# Altium schematic sheet power.SchDoc
size A4
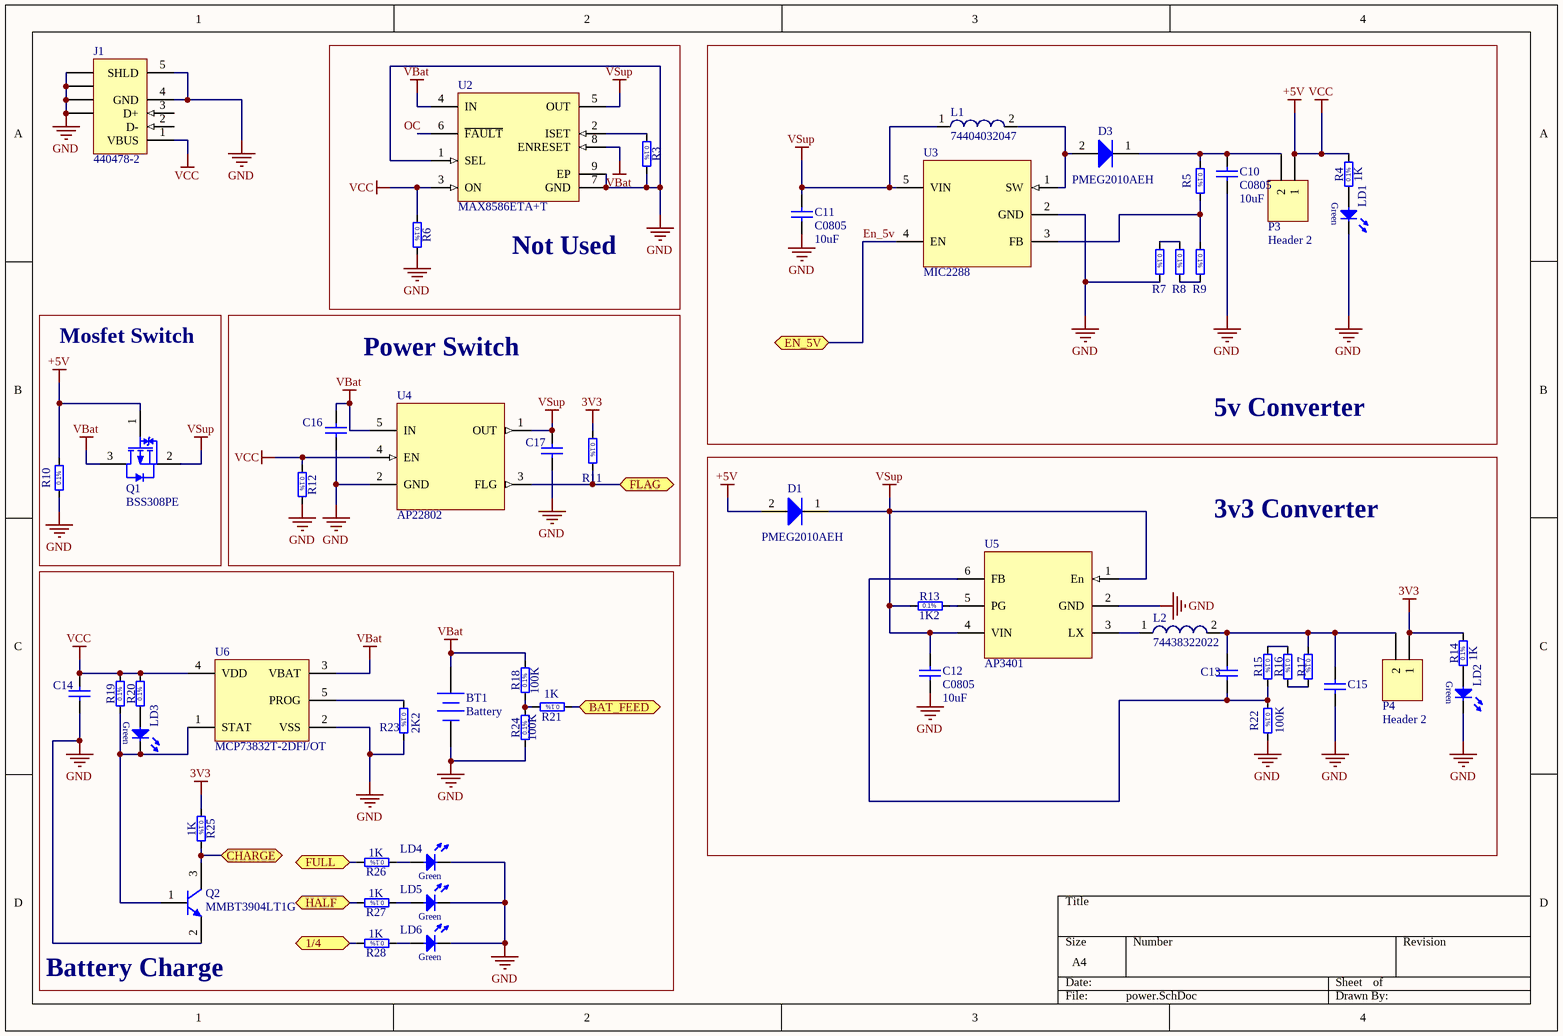
[diagram p0: power.SchDoc]

## Parts
BT1  Battery  [BAT-2]
C10  C0805  value 10uF  [0805]
C11  C0805  value 10uF  [0805]
C12  C0805  value 10uF  [0805]
C13  C0805  [0805]  (value not drawn)
C14  C0805  [0805]  (value not drawn)
C15  C0805  [0805]  (value not drawn)
C16  C0805  [0805]  (value not drawn)
C17  C0805  [0805]  (value not drawn)
D1  PMEG2010AEH  [ONSC-SOD-123-2-425-04_V]
D3  PMEG2010AEH  [ONSC-SOD-123-2-425-04_V]
J1  440478-2  [440478]
L1  74404032047  [WE-LQS 3015]
L2  74438322022  [SMD 2508]
LD1  Green  [LED_OSRAM_LGR971]  (value not drawn)
LD2  Green  [LED_OSRAM_LGR971]  (value not drawn)
LD3  Green  [LED_OSRAM_LGR971]  (value not drawn)
LD4  Green  [LED_OSRAM_LGR971]  (value not drawn)
LD5  Green  [LED_OSRAM_LGR971]  (value not drawn)
LD6  Green  [LED_OSRAM_LGR971]  (value not drawn)
P3  Header 2  [HDR1X2]
P4  Header 2  [HDR1X2]
Q1  BSS308PE  [INF-PG-SOT23_N]
Q2  MMBT3904LT1G  [ONSC-SOT-23-3-318-08_V]
R3  26K  [RESC2012X60N]  (value not drawn)
R4  1K  [RESC2012X60N]
R5  100K  [RESC2012X60N]  (value not drawn)
R6  1K2  [RESC2012X60N]  (value not drawn)
R7  10K  [RESC2012X60N]  (value not drawn)
R8  1K  [RESC2012X60N]  (value not drawn)
R9  100R  [RESC2012X60N]  (value not drawn)
R10  1K2  [RESC2012X60N]  (value not drawn)
R11  10K  [RESC2012X60N]  (value not drawn)
R12  1K2  [RESC2012X60N]  (value not drawn)
R13  1K2  [RESC2012X60N]
R14  1K  [RESC2012X60N]
R15  RC0805FR-07430KL  [RESC2012X60N]  (value not drawn)
R16  150K  [RESC2012X60N]  (value not drawn)
R17  150K  [RESC2012X60N]  (value not drawn)
R18  100K  [RESC2012X60N]
R19  1K  [RESC2012X60N]  (value not drawn)
R20  1K  [RESC2012X60N]  (value not drawn)
R21  1K  [RESC2012X60N]
R22  100K  [RESC2012X60N]
R23  2K2  [RESC2012X60N]
R24  100K  [RESC2012X60N]
R25  1K  [RESC2012X60N]
R26  1K  [RESC2012X60N]
R27  1K  [RESC2012X60N]
R28  1K  [RESC2012X60N]
U2  MAX8586ETA+T  [T833+2]
U3  MIC2288  [TSOT25]
U4  AP22802  [TSOT25]
U5  AP3401  [TSOT26]
U6  MCP73832T-2DFI/OT  [SOT-23-OT5_N]

## Blocks framed on the sheet
Not Used: R3 R6 U2
5v Converter: C10 C11 D3 L1 LD1 P3 R4 R5 R7-R9 U3
Mosfet Switch: Q1 R10
Power Switch: C16 C17 R11 R12 U4
3v3 Converter: C12 C13 C15 D1 L2 LD2 P4 R13-R17 R22 U5
Battery Charge: BT1 C14 LD3-LD6 Q2 R18-R21 R23-R28 U6

## Ports
1/4, BAT_FEED, CHARGE, EN_5V, FLAG, FULL, HALF

## Nets
3V3: P4.1 R11.1 R14.2 R25.1
+5V: C14.2 D1.2(A) J1.1(VBUS) P3.1 Q1.1(GATE) R4.2 R6.1 R10.2 R12.1 R19.2 R20.2 U2.3(ON) U4.4(EN) U6.4(VDD)  [also labelled VCC]
GND: BT1.2(-) C10.1 C11.1 C12.1 C14.1 C15.1 C16.2 C17.1 J1.4(GND) J1.5(SHLD) J1.6(SHLD) J1.7(SHLD) J1.8(SHLD) J1.9(SHLD) LD1.1(C) LD2.1(C) LD4.1(C) LD5.1(C) LD6.1(C) Q2.2(E) R3.2 R6.2 R7.2 R10.1 R12.2 R22.2 R23.2 R24.1 U2.1(SEL) U2.7(GND) U2.9(EP) U3.2(GND) U4.2(GND) U5.2(GND) U6.2(VSS)
VBat: BT1.1(+) C16.1 Q1.3(DRAIN) R18.2 U2.4(IN) U2.8(ENRESET) U4.5(IN) U6.3(VBAT)
VSup: C11.2 C12.2 C17.2 D1.1(K) L1.1 Q1.2(SOURCE) R13.2 U2.5(OUT) U3.5(VIN) U4.1(OUT) U5.1(En) U5.4(VIN)
1/4: R28.2 ; port 1/4
BAT_FEED: R21.1 ; port BAT_FEED
CHARGE: Q2.3(C) R25.2 ; port CHARGE
En_5v: U3.4(EN) ; port EN_5V
FLAG: R11.2 U4.3(FLG) ; port FLAG
FULL: R26.2 ; port FULL
HALF: R27.2 ; port HALF
NetC10_2: C10.2 D3.1(K) P3.2 R5.1
NetC13_1: C13.1 R15.2 R22.1 U5.6(FB)
NetC13_2: C13.2 C15.2 L2.2 P4.2 R17.1
NetD3_2: D3.2(A) L1.2 U3.1(SW)
NetL2_1: L2.1 U5.3(LX)
NetLD1_2: LD1.2(A) R4.1
NetLD2_2: LD2.2(A) R14.1
NetLD3_1: LD3.1(C) Q2.1(B) R19.1 U6.1(STAT)
NetLD3_2: LD3.2(A) R20.1
NetLD4_2: LD4.2(A) R26.1
NetLD5_2: LD5.2(A) R27.1
NetLD6_2: LD6.2(A) R28.1
NetR3_1: R3.1 U2.2(ISET)
NetR5_2: R5.2 R9.1 U3.3(FB)
NetR7_1: R7.1 R8.1
NetR8_2: R8.2 R9.2
NetR13_1: R13.1 U5.5(PG)
NetR15_1: R15.1 R16.1
NetR16_2: R16.2 R17.2
NetR18_1: R18.1 R21.2 R24.2
NetR23_1: R23.1 U6.5(PROG)

Not connected (* = marked no-connect by the designer): J1 2(D-) 3(D+); U2 6(~{FAULT})

## Notes on the sheet
- Labels drawn without touching a wire or pin: OC
- (in symbol R0805_1K1_0.1%_0.1W_10PPM) 0.1%

## Library data of the parts
BT1 = Battery: Multicell Battery; Published: 24-Mar-1999; LatestRevisionDate: 17-Jul-2002; LatestRevisionNote: Re-released for DXP Platform.; PackageReference: BAT-2; Publisher: Altium Limited; PackageDescription: Battery; 2 Leads
C10-C12 = C0805: Ceramic Chip Capacitor - Standard; Note: Footprint corresponds to dimensions for bulk cassette packaging. This case size has tightened tolerances.; Published: 17-Jul-2002; LatestRevisionDate: 19-Mar-2004; LatestRevisionNote: Silkscreen size reduced.; DatasheetDocument: Mar-2001; PackageDocument: Mar-2001; PackageReference: 0805; Publisher: Altium Limited; Code_JEITA: 0805; Code_IPC: 2012[0805]; ComponentLink1Description: Manufacturer Link; ComponentLink1URL: http://www.kemet.com/; ComponentLink2Description: Datasheet; ComponentLink2URL: http://www.kemet.com/kemet/web/homepage/kechome.nsf/vapubfilesname/F3102TA.pdf/$file/F3102TA.pdf
C13 = C0805: Ceramic Chip Capacitor - Standard; Note: Footprint corresponds to dimensions for bulk cassette packaging. This case size has tightened tolerances.; Value: 22pF; Published: 17-Jul-2002; LatestRevisionDate: 19-Mar-2004; LatestRevisionNote: Silkscreen size reduced.; DatasheetDocument: Mar-2001; PackageDocument: Mar-2001; PackageReference: 0805; Publisher: Altium Limited; Code_JEITA: 0805; Code_IPC: 2012[0805]; ComponentLink1Description: Manufacturer Link; ComponentLink1URL: http://www.kemet.com/; ComponentLink2Description: Datasheet; ComponentLink2URL: http://www.kemet.com/kemet/web/homepage/kechome.nsf/vapubfilesname/F3102TA.pdf/$file/F3102TA.pdf
C14-C17 = C0805: Ceramic Chip Capacitor - Standard; Note: Footprint corresponds to dimensions for bulk cassette packaging. This case size has tightened tolerances.; Value: 10uF; Published: 17-Jul-2002; LatestRevisionDate: 19-Mar-2004; LatestRevisionNote: Silkscreen size reduced.; DatasheetDocument: Mar-2001; PackageDocument: Mar-2001; PackageReference: 0805; Publisher: Altium Limited; Code_JEITA: 0805; Code_IPC: 2012[0805]; ComponentLink1Description: Manufacturer Link; ComponentLink1URL: http://www.kemet.com/; ComponentLink2Description: Datasheet; ComponentLink2URL: http://www.kemet.com/kemet/web/homepage/kechome.nsf/vapubfilesname/F3102TA.pdf/$file/F3102TA.pdf
D1 D3 = MMSD914T3G: Switching Diode, 2-Pin SOD-123, Pb-Free, Tape and Reel; Manufacturer: On Semiconductor; Configuration: Single; IF Max (A): 0.2; trr Max (ns): 4; DatasheetVersion: Rev. 11; PackageVersion: Rev. G, 10/2009; PackageReference: SOD-123-2-425-04; PackageDescription: 2-Pin SOD, Body 1.6 x 2.69 mm; Supplier 1: Digi-Key; Supplier Part Number 1: MMSD914T3G-ND; Supplier 2: Newark; Supplier Part Number 2: 42K1367; Supplier 3: Mouser; Supplier Part Number 3: 863-MMSD914T3G; Packing: Tape and Reel; RoHS: TRUE; Mounting Technology: Surface Mount; PartNumber: MMSD914T3G; ComponentLink1Description: Manufacturer URL; ComponentLink1URL: http://www.onsemi.com/; ComponentLink2Description: Datasheet; ComponentLink2URL: http://www.onsemi.com/pub_link/Collateral/MMSD914T1-D.PDF; ComponentLink3Description: Package Specification; ComponentLink3URL: http://www.onsemi.com/pub_link/Collateral/425-04.PDF
J1 = 440478-2: USB 2.0, Right Angle, SMT, A Type, Receptacle, 5 Position, Black; ContactMaterial: Phosphor Bronze; ContactPlating: Gold (30) over Nickel; PCB_Layout: Complies with manufacturer's recommendation.; DrillSize: Corresponds to nominal value.; PanelGround: Without; Published: 15-Jul-2004; DatasheetDocument: 15-Nov-2002; PackageDocument: 15-Nov-2002; PackageReference: 440478; Publisher: Altium Limited; HousingMaterial: Thermoplastic; ComponentLink1Description: Manufacturer Link; ComponentLink1URL: http://www.tycoelectronics.com/; ComponentLink2Description: Packaging Specification; ComponentLink2URL: http://ecommas.tycoelectronics.com/commerce/DocumentDelivery/DDEController?Action=showdoc&DocId=Customer+Drawing%7F440478%7FB%7Fpdf%7FEnglish%7FC_440478_B.pdf
L1 = 74404032047: WE-LQS SMD Power Inductor, L=4.7 µH; Inductance: 4.7 µH; PackageReference: WE-LQS 3015; PartNumber: 74404032047; ComponentLink1Description: Manufacturer URL; ComponentLink1URL: http://www.we-online.com; ComponentLink2Description: Datasheet; ComponentLink2URL: http://katalog.we-online.de/pbs/datasheet/74404032047.pdf
L2 = 74438322022: Power Multilayer Inductor WE-MAPI, L=2.2µH; Inductance: 2.2µH; PackageReference: SMD 2508; PartNumber: 74438322022; ComponentLink1Description: Manufacturer URL; ComponentLink1URL: http://www.we-online.com; ComponentLink2Description: Datasheet; ComponentLink2URL: http://katalog.we-online.de/kataloge/eisos/media/pdf/74438322022.pdf
LD1-LD6 = LED_OSRAM_LGR971: LED Green 1C 2A; Part Description: Surface Mount Green LED (0805 Case); Manufacturer: OSRAM; Manufacturer Part Number: LGR971; Table: LEDs & Displays; Part Number: LED_OSRAM_LGR971; Component Kind: Standard; Component Type: Standard; Color: Green; PackageDescription: Green Chip LED, 2-Leads, Body 2.0x1.25mm, IPC Medium Density; Pin Count: 2; Case: 0805; Mounted: Yes; Socket: No; SMD: Yes; ComponentHeight: 0.9mm; HelpURL: \\cern.ch\dfs\Applications\Altium\Datasheets\LED_OSRAM_LGR971.pdf; Author: CERN DEM JLC; CreateDate: 28.01.2009; LatestRevisionDate: 17.03.2010
P3 P4 = Header 2: Header, 2-Pin; LatestRevisionDate: 17-Jul-2002; LatestRevisionNote: Re-released for DXP Platform.; Publisher: Altium Limited
Q1 = BSS308PE: P-Channel OptiMOS P3 Small-Signal-Transistor, -30 V VDS, -2 A ID, -55 to 150 degC, PG-SOT23, Reel, Green; Manufacturer: Infineon; Green: TRUE; ID (max): -2 A; IDpuls (max): -8 A; Pto t (max): 0.5 W; QG: -5 nC; RDS (on) (max): 80 mOhm; RDS (on) (max) (@4.5V): 130 mOhm; Rth: 250 K/W; VDS (max): -30 V; VGS(th) (max): -1 V; VGS(th) (min): -2 V; DatasheetVersion: Rev. 2.03; PackageVersion: Apr-08; PackageReference: PG-SOT23; PackageDescription: 3-Pin Small Outline Transistor Package, 2.9 x 1.3 mm Body, 0.95 mm Pitch; Halogen-free: TRUE; Packing: Reel; Mounting Technology: Surface Mount; PartNumber: BSS308PE; ComponentLink1Description: Manufacturer URL; ComponentLink1URL: http://www.infineon.com/; ComponentLink2Description: Datasheet; ComponentLink2URL: http://www.infineon.com/dgdl/BSS308PE_Rev23_.pdf?folderId=db3a304314dca38901154a72e3951a65&fileId=db3a304330f686060131099c80400073; ComponentLink3Description: Package Specification; ComponentLink3URL: http://www.infineon.com/dgdl/SOT23-Package_Overview.pdf?folderId=db3a30431936bc4b0119532290053c66&fileId=db3a30431936bc4b0119533468123c85
Q2 = MMBT3904LT1G: General Purpose Transistor, NPN Silicon, 3-Pin SOT-23, Pb-Free, Tape and Reel; Manufacturer: On Semiconductor; fT Min (MHz): 300; IC Continuous (A): 0.2; DatasheetVersion: Rev. 12; PackageVersion: Rev. AP, 11/2009; PackageReference: SOT-23-3-318-08; PackageDescription: 3-Pin Small Outline Transistor, Body 2.92 x 1.3 mm, Pitch 0.95 mm; Supplier 1: Digi-Key; Supplier Part Number 1: MMBT3904LT1GOSTR-ND; Supplier 2: Digi-Key; Supplier Part Number 2: MMBT3904LT1GOSCT-ND; Supplier 3: Digi-Key; Supplier Part Number 3: MMBT3904LT1GOSDKR-ND; Supplier 4: Farnell; Supplier Part Number 4: 2317804; Supplier 5: Farnell; Supplier Part Number 5: 1459100; Supplier 6: Farnell; Supplier Part Number 6: 1459100RL; Supplier 7: Newark; Supplier Part Number 7: 83K0942; Supplier 8: Newark; Supplier Part Number 8: 83H7337; Supplier 9: Newark; Supplier Part Number 9: 28X7922; Supplier 10: Mouser; Supplier Part Number 10: 863-MMBT3904LT1G; Packing: Tape and Reel; Polarity: NPN; RoHS: TRUE; Mounting Technology: Surface Mount; PartNumber: MMBT3904LT1G; ComponentLink1Description: Manufacturer URL; ComponentLink1URL: http://www.onsemi.com/; ComponentLink2Description: Datasheet; ComponentLink2URL: http://www.onsemi.cn/pub_link/Collateral/MMBT3904LT1-D.PDF; ComponentLink3Description: Package Specification; ComponentLink3URL: http://www.onsemi.cn/pub_link/Collateral/318-08.PDF
R3-R14 R16-R28 = R0805_1K1_0.1%_0.1W_10PPM: Resistor - 0.1%; Part Description: Thin Film Chip Resistor; Manufacturer: GENERIC; Manufacturer1 Part Number: RN73C2A1K1BTG; Power: 0.1W; TC: ±10ppm; Table: Resistors SMD; Part Number: R0805_1K1_0.1%_0.1W_10PPM; Component Kind: Standard; Component Type: Standard; Pin Count: 2; Status: Not recommended; Tolerance: ±0.1%; Manufacturer Part Number: R0805_1K1_0.1%_0.1W_10PPM; Case: 0805; Mounted: Yes; Socket: No; SMD: Yes; Manufacturer1 Example: TYCO HOLSWORTHY; Manufacturer1 ComponentHeight: 0.6mm; HelpURL: \\cern.ch\dfs\Applications\Altium\Datasheets\R0805_Tyco_RN73.pdf; Author: CERN DEM JLC; CreateDate: 03.12.2007; LatestRevisionDate: 13.03.2008
  R3: Value: 26K
  R4 R8 R14 R19-R21 R25-R28: Value: 1K
  R5 R18 R22 R24: Value: 100K
  R6 R10 R12 R13: Value: 1K2
  R7 R11: Value: 10K
  R9: Value: 100R
  R16 R17: Value: 150K
  R23: Value: 2K2
R15 = R0805_1K1_0.1%_0.1W_10PPM: Resistor - 0.1%; Part Description: Thin Film Chip Resistor; Manufacturer: GENERIC; Manufacturer1 Part Number: RN73C2A1K1BTG; Value: 150K; Power: 0.1W; TC: ±10ppm; Table: Resistors SMD; Part Number: R0805_1K1_0.1%_0.1W_10PPM; Component Kind: Standard; Component Type: Standard; Pin Count: 2; Status: Not recommended; Tolerance: ±0.1%; Manufacturer Part Number: R0805_1K1_0.1%_0.1W_10PPM; Case: 0805; Mounted: Yes; Socket: No; SMD: Yes; Manufacturer1 Example: TYCO HOLSWORTHY; Manufacturer1 ComponentHeight: 0.6mm; HelpURL: \\cern.ch\dfs\Applications\Altium\Datasheets\R0805_Tyco_RN73.pdf; Author: CERN DEM JLC; CreateDate: 03.12.2007; LatestRevisionDate: 13.03.2008
U2 = MAX8586ETA+T: Single 1.2A USB Switch, 8-Pin TDFN, -40°C to +85°C, Pb-Free, Tape and Reel; DatasheetVersion: Rev 2, Jan-2010; PackageVersion: revJ, 2009; PackageReference: T833+2; PackageDescription: 8-Pin Plastic Very Very Thin Dual Flatpack No Leads, Exposed Pad, 3 x 3 x 0.8 mm Body, TDFN-EP, Pb-Free; Code_JEDEC: MO-229-WEEC; ComponentLink1Description: Manufacturer URL; ComponentLink1URL: http://www.maxim-ic.com; ComponentLink2Description: Datasheet; ComponentLink2URL: http://datasheets.maxim-ic.com/en/ds/MAX8586.pdf; ComponentLink3Description: Package Specification; ComponentLink3URL: http://pdfserv.maxim-ic.com/package_dwgs/21-0137.PDF
U6 = MCP73832T-2DFI/OT: Miniature Single-Cell, Fully Integrated Li-Ion, Li-Polymer Charge Management Controller, 4.2V, 5-Pin SOT-23, Industrial Temperature, Tape and Reel; Manufacturer: Microchip; DatasheetVersion: revE, Sep-2008; PackageVersion: revBB, Aug-2009; PackageReference: SOT-23-OT5; PackageDescription: 5-Lead Plastic Small Outline Transistor (OT) [SOT-23]; Supplier 1: Digi-Key; Supplier Part Number 1: MCP73832T-2DFI/OTTR-ND; Supplier 2: Digi-Key; Supplier Part Number 2: MCP73832T-2DFI/OTCT-ND; Supplier 3: Digi-Key; Supplier Part Number 3: MCP73832T-2DFI/OTDKR-ND; Supplier 4: Newark; Supplier Part Number 4: 08R1849; Supplier 5: Mouser; Supplier Part Number 5: 579-MCP73832T2DFI/OT; Mounting Technology: Surface Mount; Code_IPC: SOT23-5; PartNumber: MCP73832T-2DFI/OT; ComponentLink1Description: Manufacturer URL; ComponentLink1URL: http://www.microchip.com/; ComponentLink2Description: Datasheet; ComponentLink2URL: http://ww1.microchip.com/downloads/en/DeviceDoc/21984e.pdf; ComponentLink3Description: Package Specification; ComponentLink3URL: http://www.microchip.com/stellent/groups/techpub_sg/documents/packagingspec/en012702.pdf